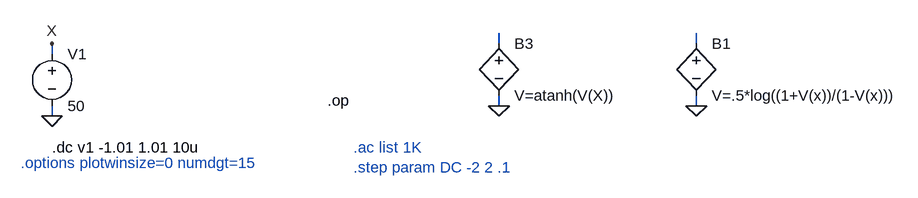
[diagram p0: schematic builtin_07_sinh.asc]
builtin_07_sinh.asc, the LTspice schematic file:
Version 4
SHEET 1 1656 680
WIRE 768 80 768 64
WIRE 1072 80 1072 64
WIRE 80 96 80 80
WIRE 768 176 768 160
WIRE 1072 176 1072 160
WIRE 80 192 80 176
FLAG 80 192 0
FLAG 80 80 X
FLAG 768 176 0
FLAG 1072 176 0
SYMBOL voltage 80 80 R0
SYMATTR InstName V1
SYMATTR Value 50
SYMBOL bv 768 64 R0
SYMATTR InstName B3
SYMATTR Value V=atanh(V(X))
SYMBOL bv 1072 64 R0
SYMATTR InstName B1
SYMATTR Value V=.5*log((1+V(x))/(1-V(x)))
TEXT 80 240 Left 2 !.dc v1 -1.01 1.01 10u
TEXT 544 240 Left 2 ;.ac list 1K\n.step param DC -2 2 .1
TEXT 32 264 Left 2 ;.options plotwinsize=0 numdgt=15
TEXT 504 168 Left 2 !.op

The netlist it stands for:
* builtin_07_sinh.asc
V1 X 0 50
B3 N001 0 V=atanh(V(X))
B1 N002 0 V=.5*log((1+V(x))/(1-V(x)))
.dc v1 -1.01 1.01 10u
* .ac list 1K
* .step param DC -2 2 .1
* .options plotwinsize=0 numdgt=15
.op
.backanno
.end